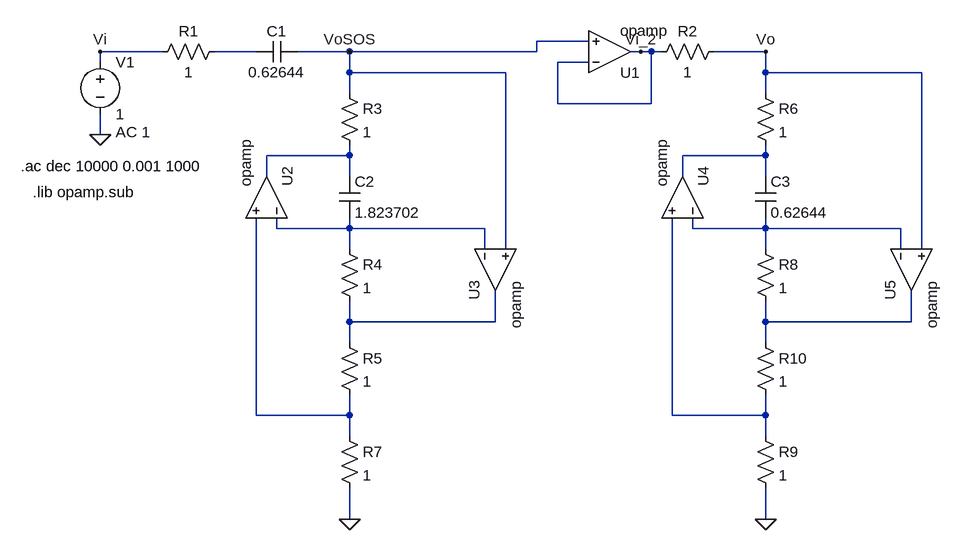
[diagram p0: schematic ts2_hpf_cheby_norm_gic.asc]
ts2_hpf_cheby_norm_gic.asc, the LTspice schematic file:
Version 4
SHEET 1 1204 980
WIRE 672 96 592 96
WIRE 16 112 -80 112
WIRE 160 112 96 112
WIRE 304 112 224 112
WIRE 592 112 592 96
WIRE 592 112 304 112
WIRE 752 112 736 112
WIRE 768 112 752 112
WIRE 784 112 768 112
WIRE 944 112 864 112
WIRE -80 128 -80 112
WIRE 672 128 624 128
WIRE 304 144 304 112
WIRE 544 144 304 144
WIRE 944 144 944 112
WIRE 1184 144 944 144
WIRE 304 176 304 144
WIRE 944 176 944 144
WIRE 624 192 624 128
WIRE 768 192 768 112
WIRE 768 192 624 192
WIRE -80 240 -80 208
WIRE 304 272 304 256
WIRE 304 272 176 272
WIRE 944 272 944 256
WIRE 944 272 816 272
WIRE 176 304 176 272
WIRE 304 304 304 272
WIRE 816 304 816 272
WIRE 944 304 944 272
WIRE 192 384 192 368
WIRE 304 384 304 368
WIRE 304 384 192 384
WIRE 512 384 304 384
WIRE 832 384 832 368
WIRE 944 384 944 368
WIRE 944 384 832 384
WIRE 1152 384 944 384
WIRE 304 416 304 384
WIRE 512 416 512 384
WIRE 544 416 544 144
WIRE 944 416 944 384
WIRE 1152 416 1152 384
WIRE 1184 416 1184 144
WIRE 304 528 304 496
WIRE 528 528 528 480
WIRE 528 528 304 528
WIRE 944 528 944 496
WIRE 1168 528 1168 480
WIRE 1168 528 944 528
WIRE 304 560 304 528
WIRE 944 560 944 528
WIRE 160 672 160 368
WIRE 304 672 304 640
WIRE 304 672 160 672
WIRE 800 672 800 368
WIRE 944 672 944 640
WIRE 944 672 800 672
WIRE 304 704 304 672
WIRE 944 704 944 672
WIRE 304 832 304 784
WIRE 944 832 944 784
FLAG -80 240 0
FLAG 944 112 Vo
FLAG -80 112 Vi
FLAG 304 112 VoSOS
FLAG 752 112 Vi_2
FLAG 304 832 0
FLAG 944 832 0
SYMBOL res 112 96 R90
WINDOW 0 0 56 VBottom 2
WINDOW 3 32 56 VTop 2
SYMATTR InstName R1
SYMATTR Value 1
SYMBOL cap 224 96 R90
WINDOW 0 0 32 VBottom 2
WINDOW 3 32 32 VTop 2
SYMATTR InstName C1
SYMATTR Value 0.62644
SYMBOL res 880 96 R90
WINDOW 0 0 56 VBottom 2
WINDOW 3 32 56 VTop 2
SYMATTR InstName R2
SYMATTR Value 1
SYMBOL Opamps\\opamp 704 176 M180
SYMATTR InstName U1
SYMBOL voltage -80 112 R0
WINDOW 123 24 124 Left 2
WINDOW 39 0 0 Left 0
SYMATTR InstName V1
SYMATTR Value 1
SYMATTR Value2 AC 1
SYMBOL Opamps\\opamp 240 336 M270
SYMATTR InstName U2
SYMBOL Opamps\\opamp 464 448 M90
SYMATTR InstName U3
SYMBOL cap 288 304 R0
SYMATTR InstName C2
SYMATTR Value 1.823702
SYMBOL res 288 160 R0
SYMATTR InstName R3
SYMATTR Value 1
SYMBOL res 288 400 R0
SYMATTR InstName R4
SYMATTR Value 1
SYMBOL res 288 688 R0
SYMATTR InstName R7
SYMATTR Value 1
SYMBOL res 288 544 R0
SYMATTR InstName R5
SYMATTR Value 1
SYMBOL Opamps\\opamp 880 336 M270
SYMATTR InstName U4
SYMBOL Opamps\\opamp 1104 448 M90
SYMATTR InstName U5
SYMBOL cap 928 304 R0
SYMATTR InstName C3
SYMATTR Value 0.62644
SYMBOL res 928 160 R0
SYMATTR InstName R6
SYMATTR Value 1
SYMBOL res 928 400 R0
SYMATTR InstName R8
SYMATTR Value 1
SYMBOL res 928 688 R0
SYMATTR InstName R9
SYMATTR Value 1
SYMBOL res 928 544 R0
SYMATTR InstName R10
SYMATTR Value 1
TEXT -202 288 Left 2 !.ac dec 10000 0.001 1000
TEXT -184 328 Left 2 !.lib opamp.sub

The netlist it stands for:
* ts2_hpf_cheby_norm_gic.asc
R1 N001 Vi 1
C1 VoSOS N001 0.62644
R2 Vo Vi_2 1
XU1 Vi_2 VoSOS Vi_2 opamp Aol=100K GBW=10Meg  ; pins invin noninvin out
V1 Vi 0 1 AC 1
XU2 N004 N008 N002 opamp Aol=100K GBW=10Meg  ; pins invin noninvin out
XU3 N004 VoSOS N006 opamp Aol=100K GBW=10Meg  ; pins invin noninvin out
C2 N002 N004 1.823702
R3 VoSOS N002 1
R4 N004 N006 1
R7 N008 0 1
R5 N006 N008 1
XU4 N005 N009 N003 opamp Aol=100K GBW=10Meg  ; pins invin noninvin out
XU5 N005 Vo N007 opamp Aol=100K GBW=10Meg  ; pins invin noninvin out
C3 N003 N005 0.62644
R6 Vo N003 1
R8 N005 N007 1
R9 N009 0 1
R10 N007 N009 1
.ac dec 10000 0.001 1000
.lib opamp.sub
.backanno
.end